# EAGLE design Steering_Wheel_USB (EAGLE 9.6.0)
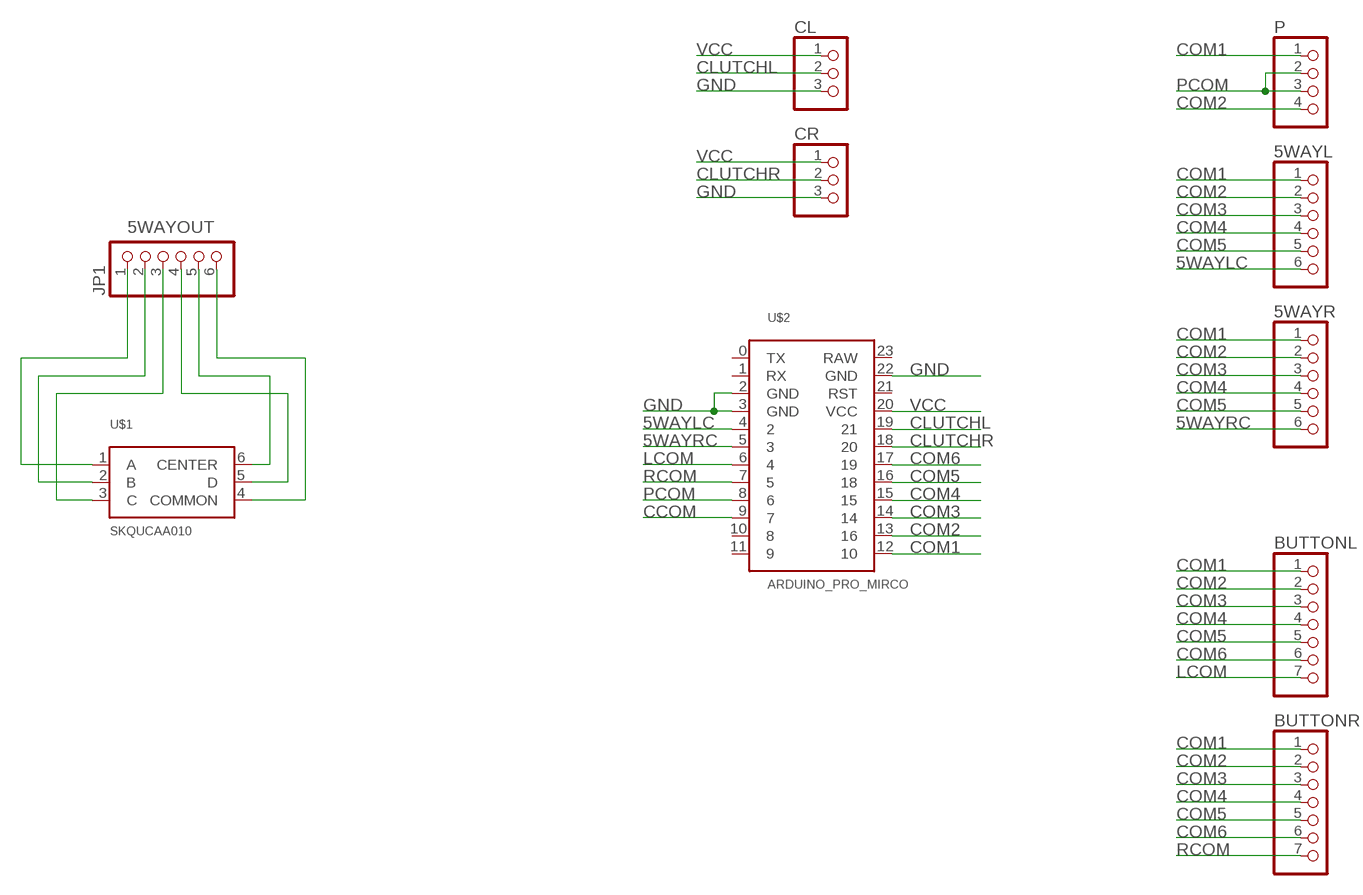
[diagram p0: schematic, sheet 1]

## Parts
5WAYL  PINHD-1X6  [1X06]
5WAYR  PINHD-1X6  [1X06]
BUTTONL  PINHD-1X7  [1X07]
BUTTONR  PINHD-1X7  [1X07]
CL  PINHD-1X3  [1X03]
CR  PINHD-1X3  [1X03]
JP1  PINHD-1X6  [1X06]
P  PINHD-1X4  [1X04]
U$1  SKQUCAA010  [SKQUCAA010]
U$2  ARDUINO_PRO_MIRCO  [ARDUINO_PRO_MICRO]

## Nets
5WAYLC: 5WAYL.6 U$2.4
5WAYOUT: JP1.1 U$1.1(A)
5WAYRC: 5WAYR.6 U$2.5
CCOM: U$2.9
CLUTCHL: CL.2 U$2.19
CLUTCHR: CR.2 U$2.18
COM1: 5WAYL.1 5WAYR.1 BUTTONL.1 BUTTONR.1 P.1 U$2.12
COM2: 5WAYL.2 5WAYR.2 BUTTONL.2 BUTTONR.2 P.4 U$2.13
COM3: 5WAYL.3 5WAYR.3 BUTTONL.3 BUTTONR.3 U$2.14
COM4: 5WAYL.4 5WAYR.4 BUTTONL.4 BUTTONR.4 U$2.15
COM5: 5WAYL.5 5WAYR.5 BUTTONL.5 BUTTONR.5 U$2.16
COM6: BUTTONL.6 BUTTONR.6 U$2.17
GND: CL.3 CR.3 U$2.2(GND) U$2.3(GND) U$2.22(GND)
LCOM: BUTTONL.7 U$2.6
N$2: JP1.2 U$1.2(B)
N$3: JP1.3 U$1.3(C)
N$4: JP1.4 U$1.5(D)
N$5: JP1.5 U$1.6(CENTER)
N$6: JP1.6 U$1.4(COMMON)
PCOM: P.2 P.3 U$2.8
RCOM: BUTTONR.7 U$2.7
VCC: CL.1 CR.1 U$2.20(VCC)
Unconnected: U$2.0(TX) U$2.1(RX) U$2.10 U$2.11 U$2.21(RST) U$2.23(RAW)

## Library data of the parts
5WAYL 5WAYR JP1 = pinhead:PINHD-1X6: PIN HEADER
BUTTONL BUTTONR = pinhead:PINHD-1X7: PIN HEADER
CL CR = pinhead:PINHD-1X3: PIN HEADER
P = pinhead:PINHD-1X4: PIN HEADER
U$1 = Dump:SKQUCAA010: Multi Control Device TACT Switch 4-direction with Center-push Function
U$2 = Dump:ARDUINO_PRO_MIRCO: Arduino Pro Micro

## Board
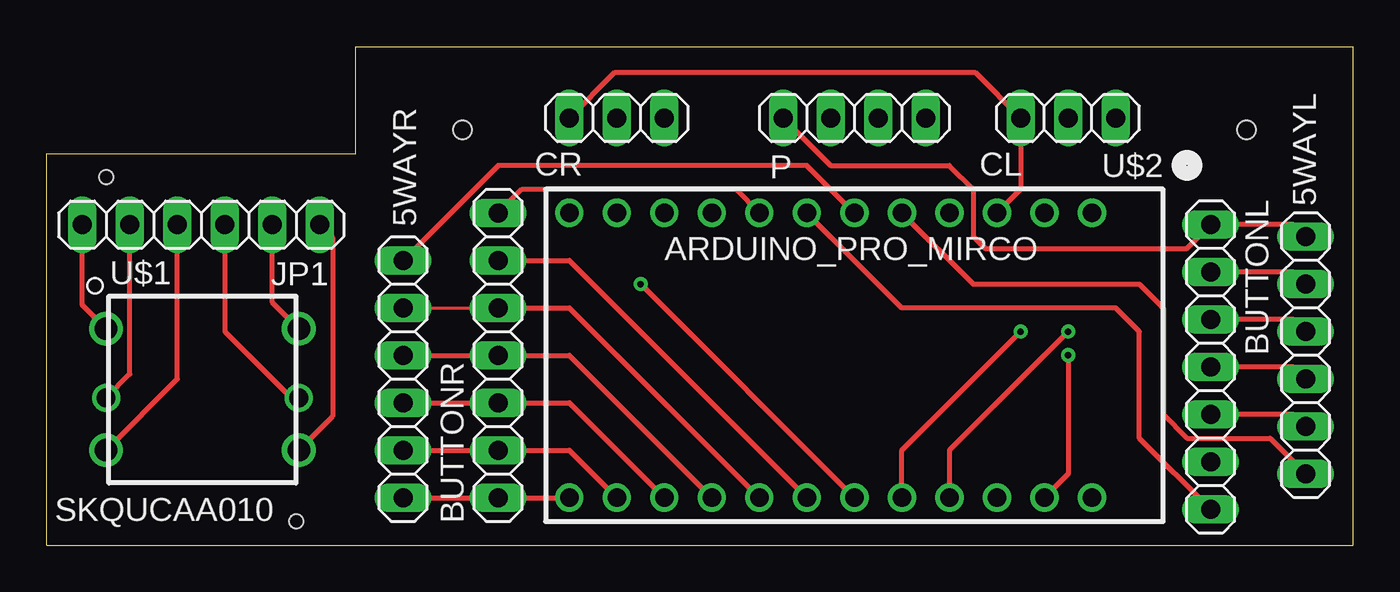
[diagram p1: board, top side]
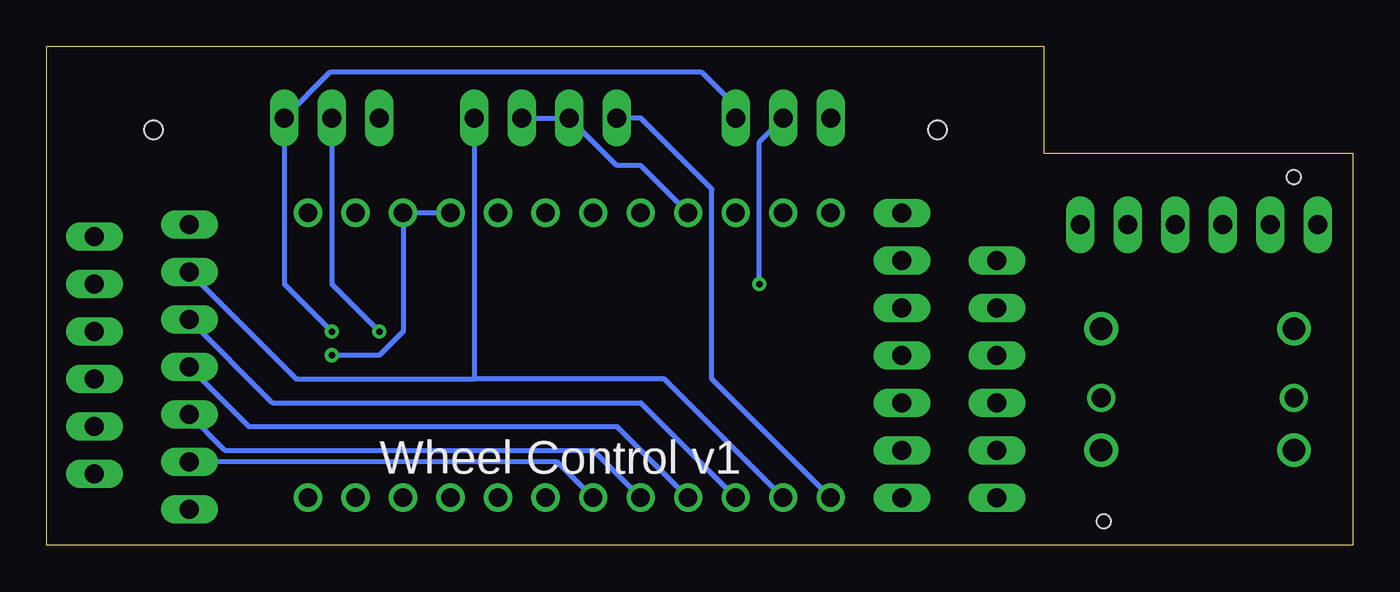
[diagram p2: board, bottom side, seen from below]

Size 69.85 x 26.67 mm. Coordinates in mm from the lower left corner, seen from the top.
Outline: 0,0 69.85,0 69.85,26.67 16.51,26.67 16.51,20.96 0,20.96 0,0
Copper layers (1*16): Top 0.035mm / dielectric 1.5mm / Bottom 0.035mm
Design rules "PCBway": minimum track width 6mil, minimum drill 0.3mm, track to track 0.205mm, track to pad 0.205mm, pad to pad 0.205mm, via to via 0.205mm, smd to smd 8mil, copper to edge 40mil, drill to drill 8mil, minimum pad ring 10mil, minimum via ring 8mil, stop-mask expansion 4mil, vias tented up to drill 25mil, thermal gap 10mil
Holes 1 mm at 22.23,22.23 64.14,22.23
Holes 0.75 mm at 3.17,19.68 13.33,1.27

### Footprints (pad centres in the part's own frame; a part is rotated, then mirrored left to right if it is on the bottom)
1X06 = drill 1.016 long: 1 -6.35,0; 2 -3.81,0; 3 -1.27,0; 4 1.27,0; 5 3.81,0; 6 6.35,0
1X07 = drill 1.016 long: 1 -7.62,0; 2 -5.08,0; 3 -2.54,0; 4 0,0; 5 2.54,0; 6 5.08,0; 7 7.62,0
1X03 = drill 1.016 long: 1 -2.54,0; 2 0,0; 3 2.54,0
1X04 = drill 1.016 long: 1 -3.81,0; 2 -1.27,0; 3 1.27,0; 4 3.81,0
SKQUCAA010 = drill 1.2: 1 0,6.5; 3 0,0; 4 10.3,0; 6 10.3,6.5 | drill 1: 2 0,2.8; 5 10.3,2.8
ARDUINO_PRO_MICRO = drill 1: 0 0,27.94; 1 0,25.4; 2 0,22.86; 3 0,20.32; 4 0,17.78; 5 0,15.24; 6 0,12.7; 7 0,10.16; 8 0,7.62; 9 0,5.08; 10 0,2.54; 11 0,0; 12 15.24,0; 13 15.24,2.54; 14 15.24,5.08; 15 15.24,7.62; 16 15.24,10.16; 17 15.24,12.7; 18 15.24,15.24; 19 15.24,17.78; 20 15.24,20.32; 21 15.24,22.86; 22 15.24,25.4; 23 15.24,27.94

### Placement (x,y rotation side)
5WAYL  67.31,10.16 270 top
5WAYR  19.05,8.89 90 top
BUTTONL  62.23,9.53 270 top
BUTTONR  24.13,10.16 90 top
CL  54.61,22.86 180 top
CR  30.48,22.86 180 top
JP1  8.25,17.14 0 top
P  43.18,22.86 0 top
U$1  3.17,5.08 0 top
U$2  27.94,17.78 270 top

### Tracks (layer width: path | path; a pad name or v marks a point on that pad's centre or on a via)
5WAYLC
  Top 0.254: U$2.4 49.53,13.97 58.42,13.97 59.69,12.7 59.69,6.99 60.96,5.71 65.41,5.71 5WAYL.6
5WAYOUT
  Top 0.254: U$1.1 1.9,12.85 JP1.1
5WAYRC
  Top 0.254: 5WAYR.6 24.13,20.32 40.64,20.32 U$2.5
CLUTCHL  (via drill 0.35)
  Top 0.254: U$2.19 45.72,5.08 v52.07,11.43
  Bottom 0.254: CL.2 54.61,13.97 v52.07,11.43
CLUTCHR  (via drill 0.35)
  Top 0.254: U$2.18 v31.75,13.97
  Bottom 0.254: CR.2 31.75,21.59 v31.75,13.97
COM1
  Top 0.254: 5WAYR.1 BUTTONR.1 U$2.12 | 5WAYL.1 66.67,17.14 BUTTONL.1 60.96,15.88 50.16,15.88 49.53,16.51 49.53,19.05 48.26,20.32 41.91,20.32 P.1
  Bottom 0.254: U$2.12 34.29,8.89 34.29,19.05 38.1,22.86 P.1
COM2
  Top 0.254: 5WAYR.2 BUTTONR.2 27.94,5.08 U$2.13 | 5WAYL.2 66.67,14.61 BUTTONL.2
  Bottom 0.254: U$2.13 36.83,8.89 46.99,8.89 | BUTTONL.2 56.52,8.89 46.99,8.89 | P.4 46.99,8.89
COM3
  Top 0.254: 5WAYR.3 BUTTONR.3 27.94,7.62 U$2.14 | 5WAYL.3 66.67,12.07 BUTTONL.3
  Bottom 0.254: U$2.14 38.1,7.62 57.78,7.62 BUTTONL.3
COM4
  Top 0.254: 5WAYR.4 BUTTONR.4 27.94,10.16 U$2.15 | 5WAYL.4 66.67,9.53 BUTTONL.4
  Bottom 0.254: U$2.15 39.37,6.35 59.05,6.35 BUTTONL.4
COM5
  Top 0.152: 5WAYR.5 BUTTONR.5
  Top 0.254: 5WAYL.5 66.67,6.99 BUTTONL.5 | BUTTONR.5 27.94,12.7 U$2.16
  Bottom 0.254: U$2.16 40.64,5.08 60.33,5.08 BUTTONL.5
COM6
  Top 0.254: BUTTONR.6 27.94,15.24 U$2.17
  Bottom 0.254: U$2.17 42.55,4.45 BUTTONL.6
GND  (via drill 0.35)
  Top 0.254: CR.3 30.38,25.3 49.63,25.3 CL.3 52.07,19.05 U$2.2 | v54.61,10.16 54.61,3.81 U$2.22
  Bottom 0.254: U$2.3 U$2.2 50.8,11.43 52.07,10.16 v54.61,10.16
LCOM
  Top 0.254: BUTTONL.7 58.42,5.71 58.42,11.43 57.15,12.7 45.72,12.7 U$2.6
N$2
  Top 0.254: U$1.2 4.45,9.15 JP1.2
N$3
  Top 0.254: U$1.3 6.98,8.89 JP1.3
N$4
  Top 0.254: JP1.4 9.52,11.43 13.07,7.88 U$1.5
N$5
  Top 0.254: U$1.6 12.06,12.99 JP1.5
N$6
  Top 0.254: JP1.6 15.29,16.46 15.29,6.89 U$1.4
PCOM
  Bottom 0.254: U$2.8 38.1,20.32 39.37,20.32 P.2 P.3
RCOM
  Top 0.254: BUTTONR.7 25.4,19.05 36.83,19.05 U$2.7
VCC  (via drill 0.35)
  Top 0.254: v54.61,11.43 48.26,5.08 U$2.20
  Bottom 0.254: CR.1 33.02,23.5 34.82,25.3 54.71,25.3 CL.1 57.15,13.97 v54.61,11.43

### Text on the board
bNames: Wheel Control v1